# Altium schematic sheet Sheet1.SchDoc
size 420 x 297 mm; Address1: Address1; Address2: Address2; Address3: Address3; Address4: Address4; DocumentNumber: АБВГ.123456.001 Э3; SheetNumber: 2; Scale: 1:1; DocumentType: Схема электрическая принципиальная; FirstReferrence: АБВГ.123456.001
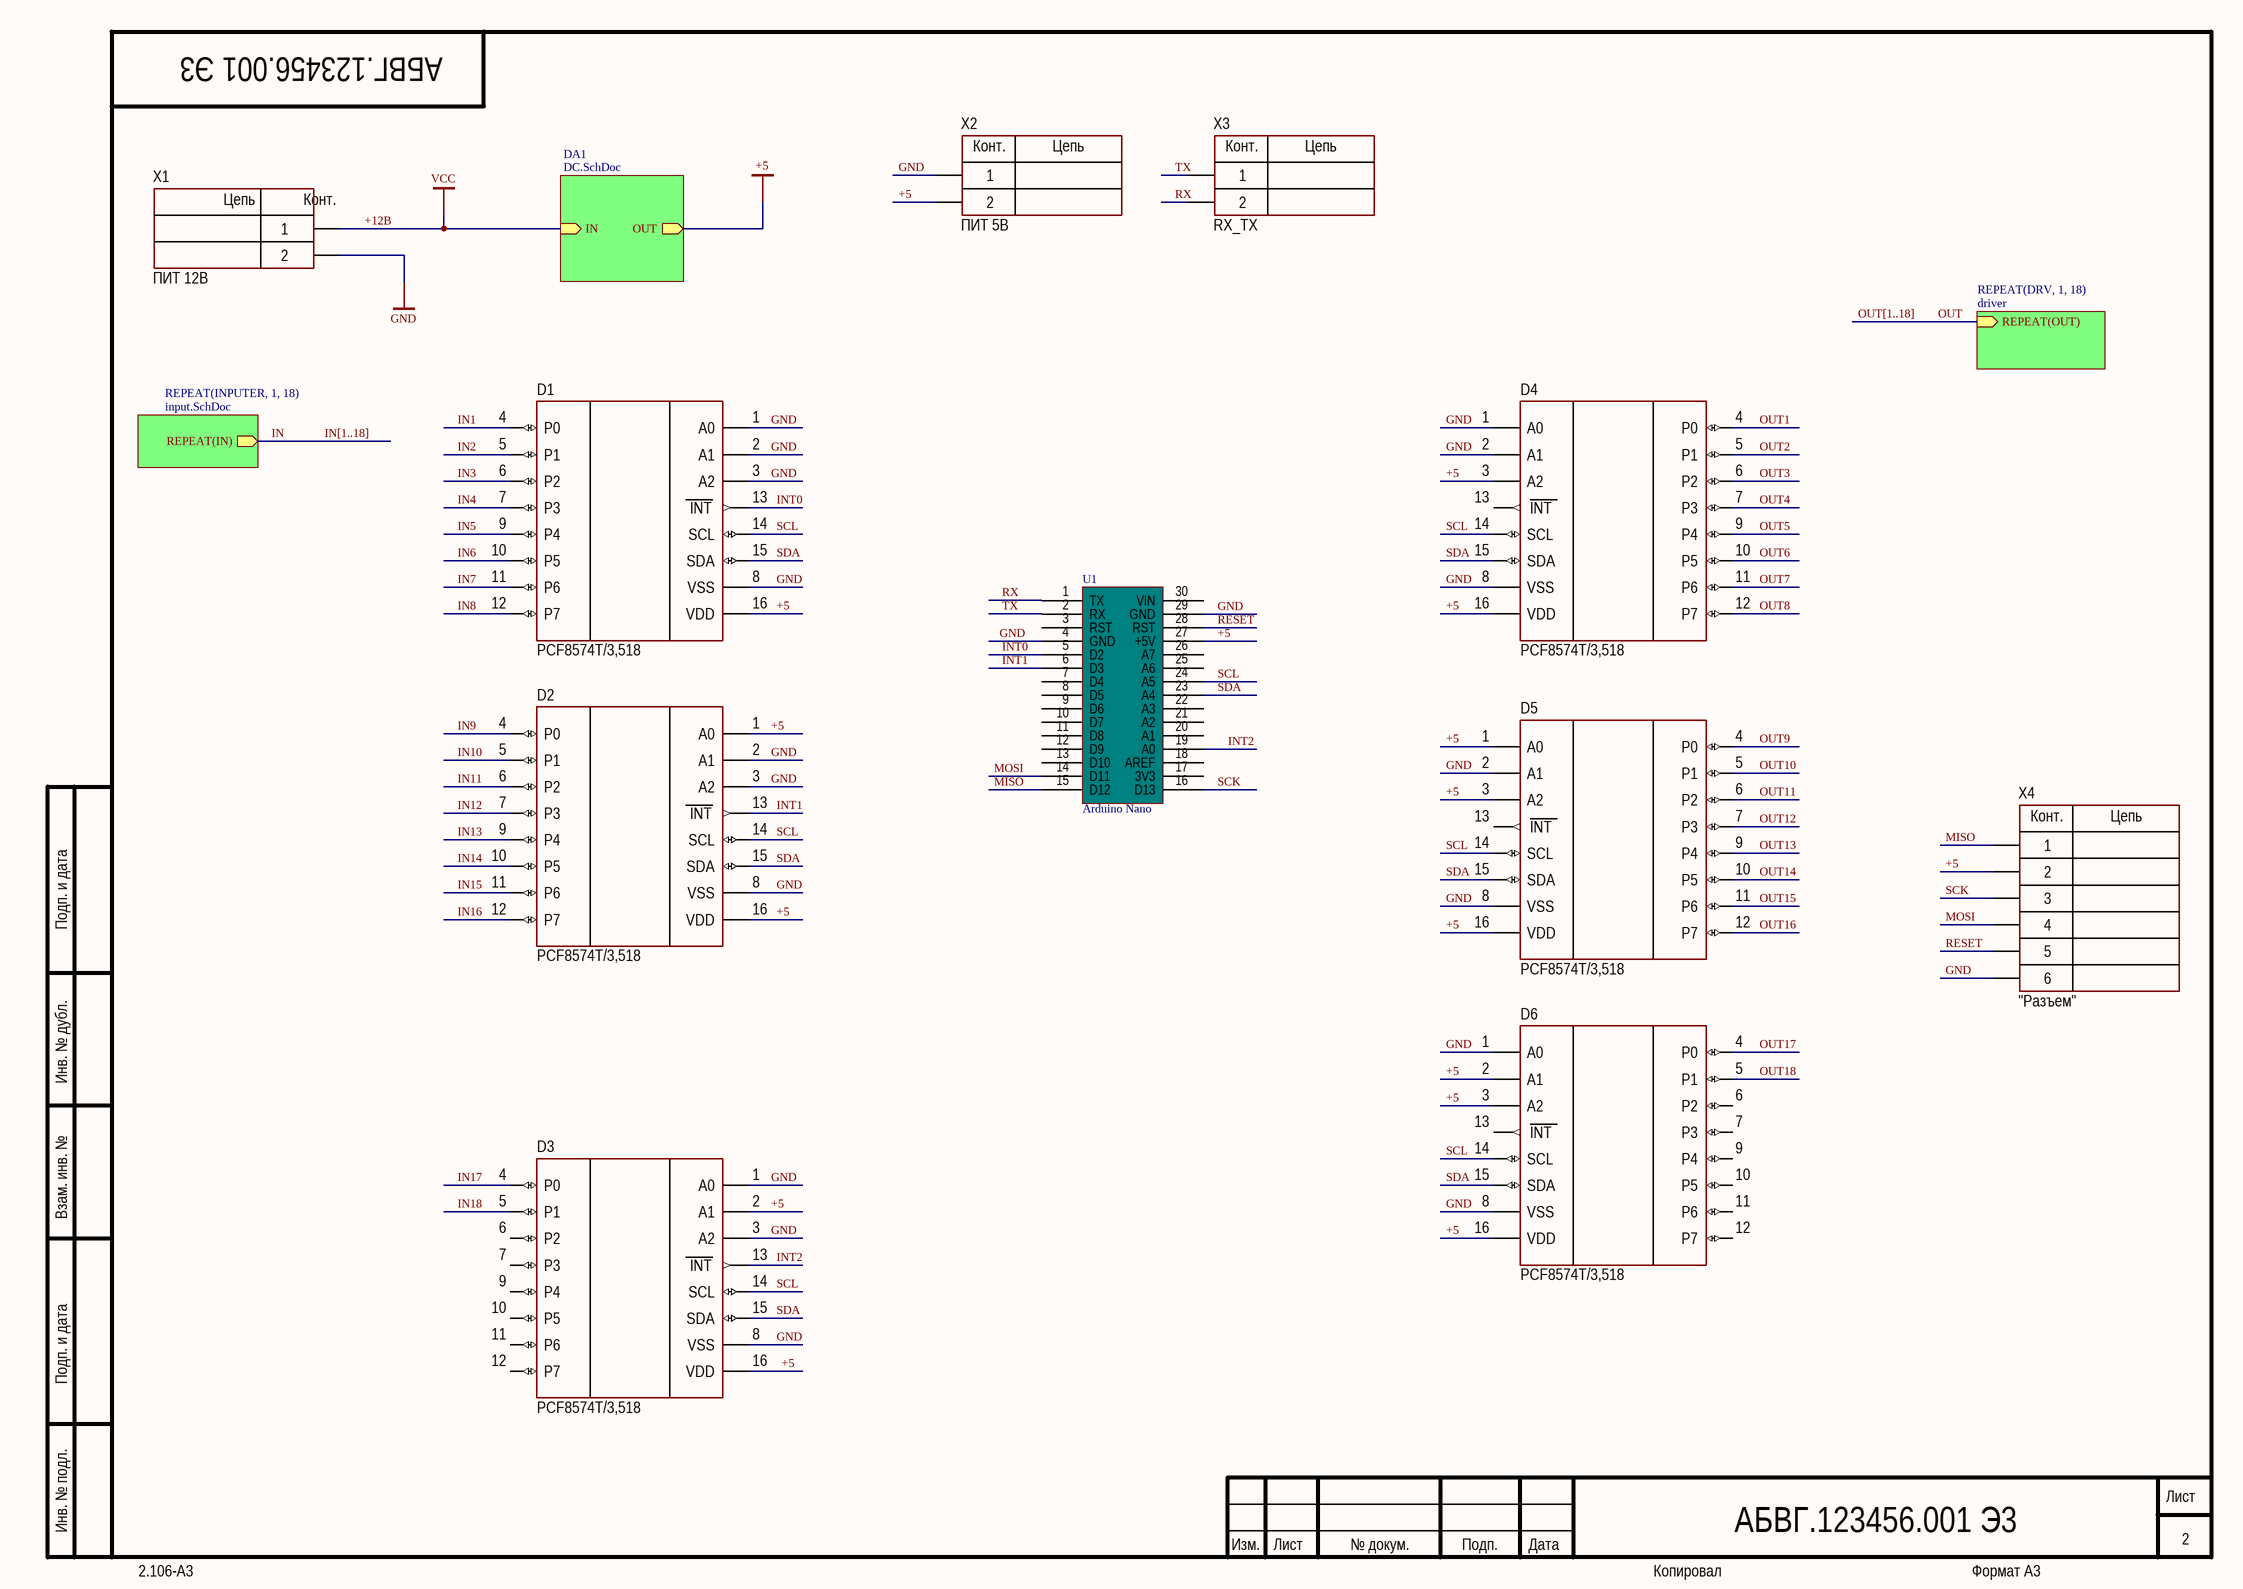
[diagram p0: Sheet1.SchDoc]

## Parts
D1  PartNumber: PCF8574T/3,518  [16-TSSOP]
D2  PartNumber: PCF8574T/3,518  [16-TSSOP]
D3  PartNumber: PCF8574T/3,518  [16-TSSOP]
D4  PartNumber: PCF8574T/3,518  [16-TSSOP]
D5  PartNumber: PCF8574T/3,518  [16-TSSOP]
D6  PartNumber: PCF8574T/3,518  [16-TSSOP]
U1  Arduino Nano  [CON: ArduinoNano]
X1  CommentText: ПИТ 12В  [TB_2_2.5MM]
X2  CommentText: ПИТ 5В  [TB_2_2.5MM]
X3  CommentText: RX_TX  [TB_2_2.5MM]
X4  CommentText: "Разъем"  [CON: PLD-6]

## Sub-sheets
DA1 = DC.SchDoc: IN (in), OUT (out)
REPEAT(DRV, 1, 18) = driver: REPEAT(OUT) (in)
REPEAT(INPUTER, 1, 18) = input.SchDoc: REPEAT(IN) (out)

## Nets
+5: D1.16(VDD) D2.1(A0) D2.16(VDD) D3.2(A1) D3.16(VDD) D4.3(A2) D4.16(VDD) D5.1(A0) D5.3(A2) D5.16(VDD) D6.2(A1) D6.3(A2) D6.16(VDD) U1.27(+5V) X2.2 X4.2 ; sheet DA1/OUT
+12В: X1.1 ; sheet DA1/IN  [also labelled VCC]
GND: D1.1(A0) D1.2(A1) D1.3(A2) D1.8(VSS) D2.2(A1) D2.3(A2) D2.8(VSS) D3.1(A0) D3.3(A2) D3.8(VSS) D4.1(A0) D4.2(A1) D4.8(VSS) D5.2(A1) D5.8(VSS) D6.1(A0) D6.8(VSS) U1.4(GND) U1.29(GND) X1.2 X2.1 X4.6
IN: sheet REPEAT(INPUTER, 1, 18)/REPEAT(IN)
IN1: D1.4(P0)
IN2: D1.5(P1)
IN3: D1.6(P2)
IN4: D1.7(P3)
IN5: D1.9(P4)
IN6: D1.10(P5)
IN7: D1.11(P6)
IN8: D1.12(P7)
IN9: D2.4(P0)
IN10: D2.5(P1)
IN11: D2.6(P2)
IN12: D2.7(P3)
IN13: D2.9(P4)
IN14: D2.10(P5)
IN15: D2.11(P6)
IN16: D2.12(P7)
IN17: D3.4(P0)
IN18: D3.5(P1)
INT0: D1.13(INT) U1.5(D2)
INT1: D2.13(INT) U1.6(D3)
INT2: D3.13(INT) U1.19(A0)
MISO: U1.15(D12) X4.1
MOSI: U1.14(D11) X4.4
OUT: sheet REPEAT(DRV, 1, 18)/REPEAT(OUT)
OUT1: D4.4(P0)
OUT2: D4.5(P1)
OUT3: D4.6(P2)
OUT4: D4.7(P3)
OUT5: D4.9(P4)
OUT6: D4.10(P5)
OUT7: D4.11(P6)
OUT8: D4.12(P7)
OUT9: D5.4(P0)
OUT10: D5.5(P1)
OUT11: D5.6(P2)
OUT12: D5.7(P3)
OUT13: D5.9(P4)
OUT14: D5.10(P5)
OUT15: D5.11(P6)
OUT16: D5.12(P7)
OUT17: D6.4(P0)
OUT18: D6.5(P1)
RESET: U1.28(RST) X4.5
RX: U1.1(TX) X3.2
SCK: U1.16(D13) X4.3
SCL: D1.14(SCL) D2.14(SCL) D3.14(SCL) D4.14(SCL) D5.14(SCL) D6.14(SCL) U1.24(A5)
SDA: D1.15(SDA) D2.15(SDA) D3.15(SDA) D4.15(SDA) D5.15(SDA) D6.15(SDA) U1.23(A4)
TX: U1.2(RX) X3.1

Not connected (* = marked no-connect by the designer): D3 6(P2) 7(P3) 9(P4) 10(P5) 11(P6) 12(P7); D4 13(INT); D5 13(INT); D6 6(P2) 7(P3) 9(P4) 10(P5) 11(P6) 12(P7) 13(INT); U1 3(RST) 7(D4) 8(D5) 9(D6) 10(D7) 11(D8) 12(D9) 13(D10) 17(3V3) 18(AREF) 20(A1) 21(A2) 22(A3) 25(A6) 26(A7) 30(VIN)

## Buses and harness runs
bus IN[1..18]
bus OUT[1..18]

## Notes on the sheet
- Подп. и дата
- Инв. № дубл.
- Взам. инв. №
- Инв. № подл.
- Изм.
- Лист
- № докум.
- Подп.
- Дата
- 2.106-A3
- Копировал
- Формат А3
- (in symbol DG308-2.54-02P-14-00A(H)) Конт.; Цепь
- (in symbol PLD-6) Конт.; Цепь

## Library data of the parts
D1-D6 = PCF8574T/3,518: Расширитель цифровых входов/выходов для шины I2C; Manufacturer: NXP Semiconductor; ValueManufacturerPartNumber: IC logic buffer, 2...6V, -40...+125°C, 20-TSSOP; Supply: 2...6V; ID: 10; ElementName: PCF8574T/3,518. 8-битный расширитель портов; URL_bying: #https://www.chipdip.ru/product/pcf8574t-3.518?ysclid=luk07hbopc633637602#; HelpURL: https://www.digikey.com/product-detail/en/nexperia-usa-inc/74HC245PW118/1727-4296-1-ND/2209913; Package: 20-TSSOP; ComponentType: IC logic buffer; Temperature: -40...+125°C; Temperature Min: -40; Temperature Max: +85; ValueSCH: PCF8574T/3,518
U1 = Arduino_Nano: ID: 12; ElementName: Ардуино Нано; Partnumber: Arduino_Nano; Manufacturer: Arduino; price: ~200 ₽; ValueSCH: Arduino Nano
X1-X3 = DG308-2.54-02P-14-00A(H): Винтовой клеммный блок c рельефной обоймой, 2 контакта. Серия DG308-2.54; Manufacturer: Китай; ValueManufacturerPartNumber: Terminal connector, 2pin, 3.5mm, 300VAC, 10A; TypeConnector: Terminal connector; VoltageMax: 300VAC; Pitch: 3.5mm; CurrentMax: 10A; Multichannel: 2pin; ID: 6; ElementName: 308-021-14, Клеммник винтовой, 2-контактный, 2.54мм, прямой; ValueSCH: Клемник 308-021-14; ChipDip: #https://www.chipdip.ru/product/308-021-12-14#; HelpURL: https://www.chipdip.ru/product/dg350-3.5-02p-12; PartNumber: DG308-2.54-02P-14-00A(H); Price: 19 ₽; Last_update: 23.11.2020
X4 = PLD-6: Manufacturer: Connfly; ValueManufacturerPartNumber: Connector, 6pin, 2.54mm, 500VAC, 3A; TypeConnector: Connector; VoltageMax: 500VAC; Pitch: 2.54mm; CurrentMax: 3A; Multichannel: 6pin; ID: 7; ElementName: Разъем 6 контактный (3 контакта в 2 ряда); HelpURL: https://www.chipdip.ru/product/pld-6; PartNumber: PLD-6; ValueSCH: PLD-6; Last_update: 30.03.2021